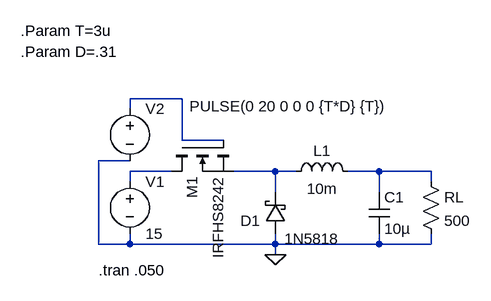
[diagram p0: schematic simple-buck.asc]
simple-buck.asc, the LTspice schematic file:
Version 4
SHEET 1 880 680
WIRE 128 -48 48 -48
WIRE 48 -32 48 -48
WIRE 128 16 128 -48
WIRE 192 16 128 16
WIRE 48 48 0 48
WIRE 112 64 48 64
WIRE 272 64 208 64
WIRE 304 64 272 64
WIRE 432 64 384 64
WIRE 512 64 432 64
WIRE 48 80 48 64
WIRE 512 80 512 64
WIRE 272 96 272 64
WIRE 432 96 432 64
WIRE 0 176 0 48
WIRE 48 176 48 160
WIRE 48 176 0 176
WIRE 272 176 272 160
WIRE 272 176 48 176
WIRE 432 176 432 160
WIRE 432 176 272 176
WIRE 512 176 512 160
WIRE 512 176 432 176
WIRE 272 192 272 176
FLAG 272 192 0
SYMBOL ind 288 80 R270
WINDOW 0 32 56 VTop 2
WINDOW 3 5 56 VBottom 2
SYMATTR InstName L1
SYMATTR Value 10m
SYMBOL schottky 288 160 R180
WINDOW 0 39 20 Left 2
WINDOW 3 -83 -8 Left 2
SYMATTR InstName D1
SYMATTR Value 1N5818
SYMATTR Description Diode
SYMATTR Type diode
SYMBOL cap 416 96 R0
SYMATTR InstName C1
SYMATTR Value 10µ
SYMBOL res 496 64 R0
SYMATTR InstName RL
SYMATTR Value 500
SYMBOL voltage 48 64 R0
WINDOW 123 0 0 Left 2
WINDOW 39 0 0 Left 2
SYMATTR InstName V1
SYMATTR Value 15
SYMBOL voltage 48 -48 R0
WINDOW 3 92 12 Left 2
WINDOW 123 0 0 Left 2
WINDOW 39 0 0 Left 2
SYMATTR Value PULSE(0 20 0 0 0 {T*D} {T})
SYMATTR InstName V2
SYMBOL nmos 112 16 M90
SYMATTR InstName M1
SYMATTR Value IRFHS8242
TEXT 0 216 Left 2 !.tran .050
TEXT -120 -152 Left 2 !.Param T=3u
TEXT -120 -120 Left 2 !.Param D=.31

The netlist it stands for:
* simple-buck.asc
L1 N003 N004 10m
D1 0 N003 1N5818
C1 N004 0 10µ
RL N004 0 500
V1 N002 0 15
V2 N001 0 PULSE(0 20 0 0 0 {T*D} {T})
M1 N002 N001 N003 N003 IRFHS8242
.model D D
.lib standard.dio
.model NMOS NMOS
.model PMOS PMOS
.lib standard.mos
.tran .050
.Param T=3u
.Param D=.31
.backanno
.end